# EAGLE design H-Bridge (EAGLE 4.11)
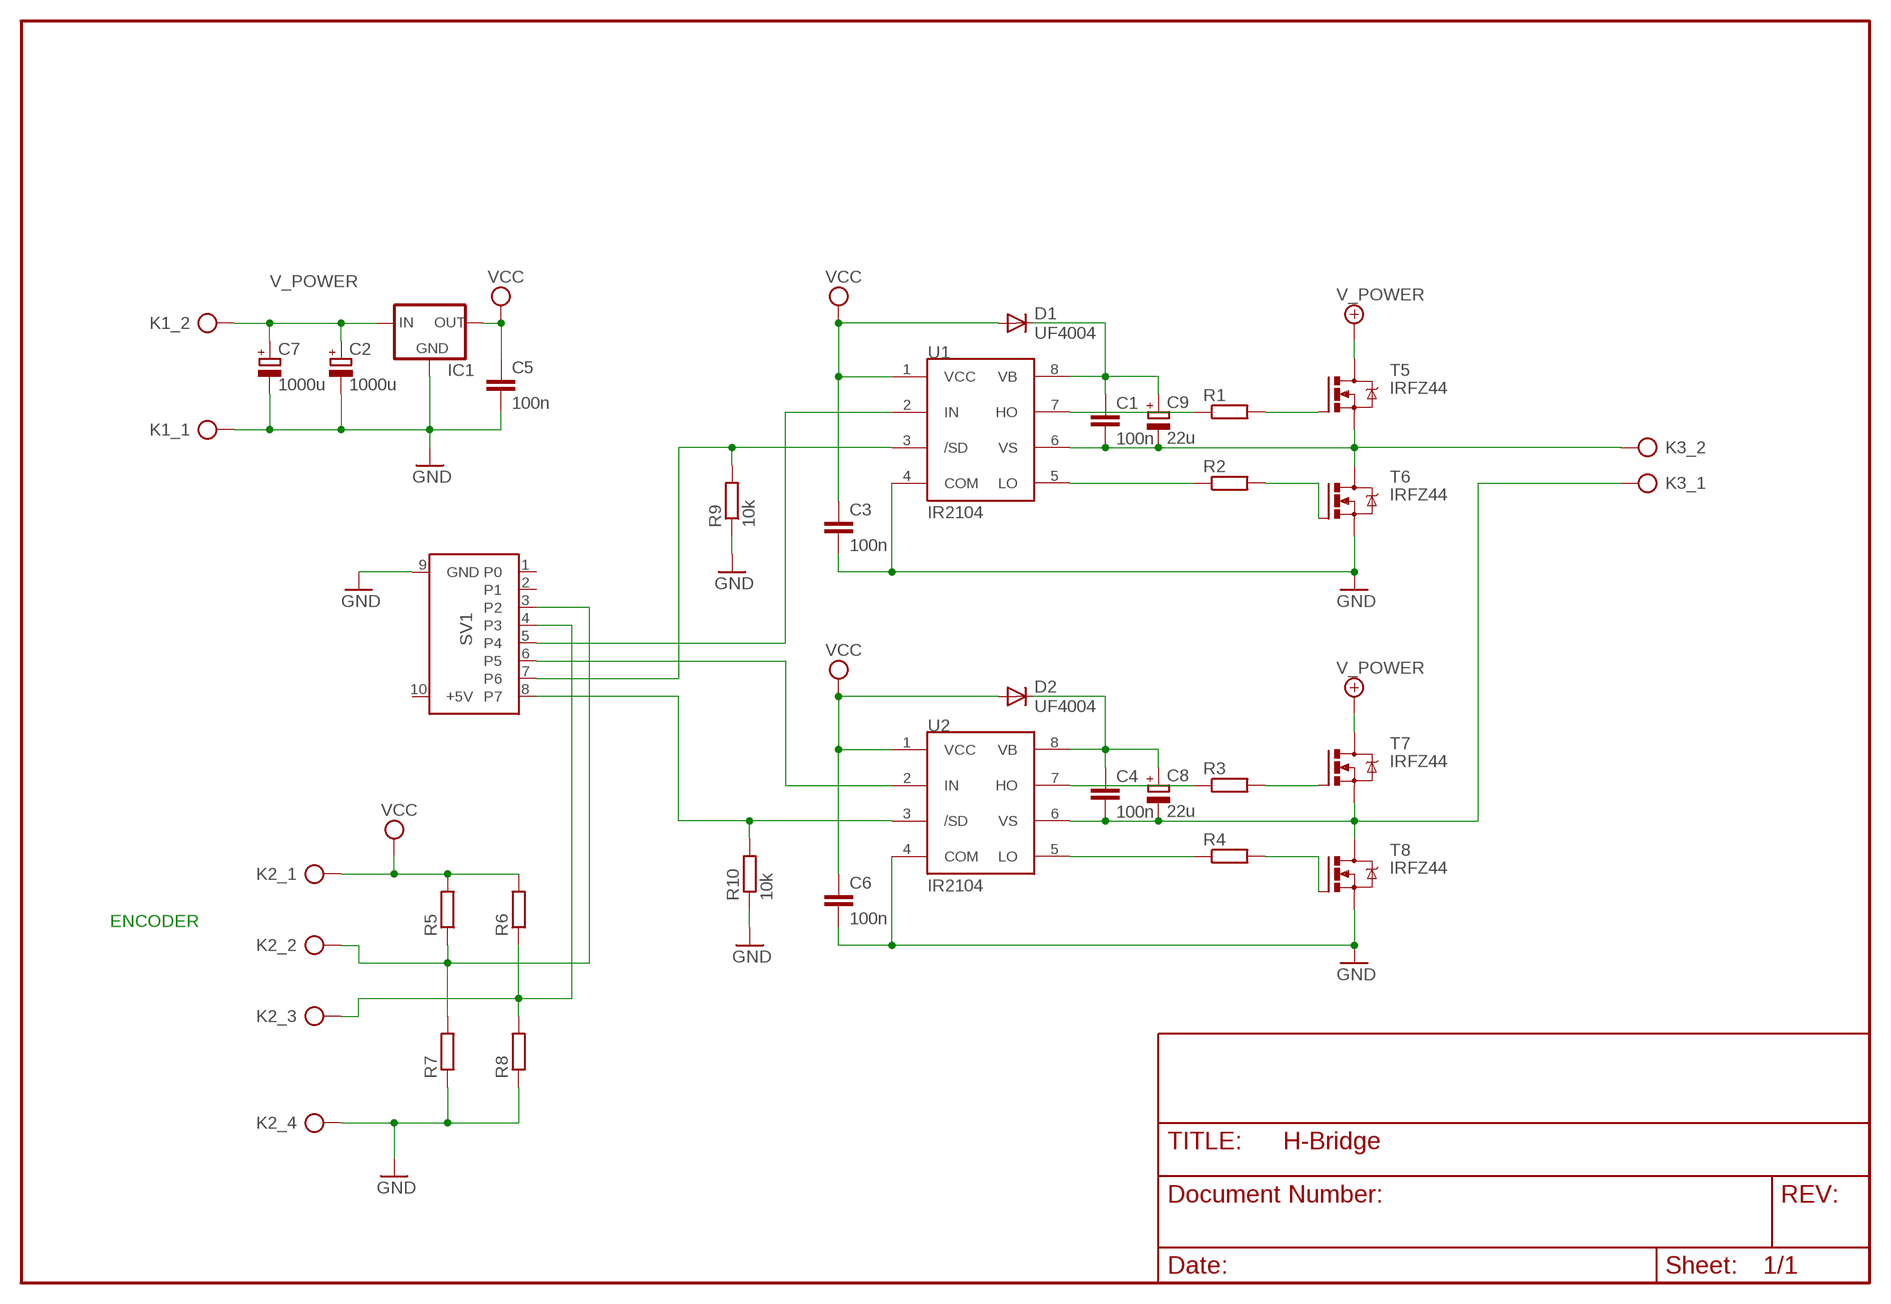
[diagram p0: schematic, sheet 1]

## Parts
C1  100n  C-EU050-025X075  [C050-025X075]
C2  1000u  CPOL-EUE5-13  [E5-13]
C3  100n  C-EU050-025X075  [C050-025X075]
C4  100n  C-EU050-025X075  [C050-025X075]
C5  100n  C-EU050-024X044  [C050-024X044]
C6  100n  C-EU050-025X075  [C050-025X075]
C7  1000u  CPOL-EUE5-13  [E5-13]
C8  22u  CPOL-EUE2.5-7  [E2,5-7]
C9  22u  CPOL-EUE2.5-7  [E2,5-7]
D1  UF4004  UF4003  [DO41-10]
D2  UF4004  UF4003  [DO41-10]
IC1  78MXXS  [78MXXS]
K1  AKL_KLEMME_2POLIG073  [AKL073-02]
K2  AST021-04  [AST021-04]
K3  AKL_KLEMME_2POLIG073  [AKL073-02]
R1  R-EU_0204/7  [0204/7]
R2  R-EU_0204/7  [0204/7]
R3  R-EU_0204/7  [0204/7]
R4  R-EU_0204/7  [0204/7]
R5  R-EU_0204/7  [0204/7]
R6  R-EU_0204/7  [0204/7]
R7  R-EU_0204/7  [0204/7]
R8  R-EU_0204/7  [0204/7]
R9  10k  R-EU_0204/7  [0204/7]
R10  10k  R-EU_0204/7  [0204/7]
SV1  PORT_WANNSTECKER  [ML10]
T5  IRFZ44  [78XXS]
T6  IRFZ44  [78XXS]
T7  IRFZ44  [78XXS]
T8  IRFZ44  [78XXS]
U1  IR2104  [DIL08]
U2  IR2104  [DIL08]

## Nets
GND: C2.- C3.2 C5.2 C6.2 C7.- IC1.GND K1.1 K2.4 R7.1 R8.1 R9.1 R10.1 SV1.9(GND) T6.S T8.S U1.4(COM) U2.4(COM)
N$1: C1.2 C9.- K3.2 T5.S T6.D U1.6(VS)
N$2: C4.2 C8.- K3.1 T7.S T8.D U2.6(VS)
N$3: R1.1 U1.7(HO)
N$4: R1.2 T5.G
N$5: R2.1 U1.5(LO)
N$6: R2.2 T6.G
N$7: R3.1 U2.7(HO)
N$8: R3.2 T7.G
N$9: R4.1 U2.5(LO)
N$10: R4.2 T8.G
N$11: SV1.5(P4) U1.2(IN)
N$12: SV1.6(P5) U2.2(IN)
N$13: R10.2 SV1.8(P7) U2.3(/SD)
N$14: R9.2 SV1.7(P6) U1.3(/SD)
N$15: K2.3 R6.1 R8.2 SV1.4(P3)
N$16: K2.2 R5.1 R7.2 SV1.3(P2)
V_POWER: C2.+ C7.+ IC1.IN K1.2 T5.D T7.D
VB1: C1.1 C9.+ D1.C U1.8(VB)
VB2: C4.1 C8.+ D2.C U2.8(VB)
VCC: C3.1 C5.1 C6.1 D1.A D2.A IC1.OUT K2.1 R5.2 R6.2 U1.1(VCC) U2.1(VCC)
Unconnected: SV1.1(P0) SV1.2(P1) SV1.10(+5V)

## Notes on the sheet
- ENCODER

## Library data of the parts
C1 C3-C6 = rcl:C-EU: CAPACITOR, European symbol
C2 C7-C9 = rcl:CPOL-EU: POLARIZED CAPACITOR, European symbol
D1 D2 = diode:UF4003: DIODE ultrafast recovery diode, 200 V rectifier
IC1 = v-reg:78MXXS: VOLTAGE REGULATOR
K1 = 01-Klemmen:AKL_KLEMME_2POLIG: Reichelt Klemme 2-Polig RM5,08
K2 = 01-Klemmen:AST021-04
K3 = FHO-Projekt:AKL_KLEMME_2POLIG: Reichelt Klemme 2-Polig RM5,08
R1-R10 = rcl:R-EU_: RESISTOR, European symbol
SV1 = FHO-Projekt:PORT_WANNSTECKER
T5-T8 = irf_voc:IRFZ44: VDSS = 55V RDS(on) = 17.5m? ID = 49A Advanced HEXFET® Power MOSFETs from International Rectifier utilize advanced processing techniques to achieve extremely low on-resistance per silicon area. This benefit, combined with the fast switching speed and ruggedized device design that HEXFET power MOSFETs are well known for, provides the designer with an extremely efficient and reliable device for use in a wide variety of applications.
U1 U2 = irf_voc:IR2104: High and low side driver

## Board
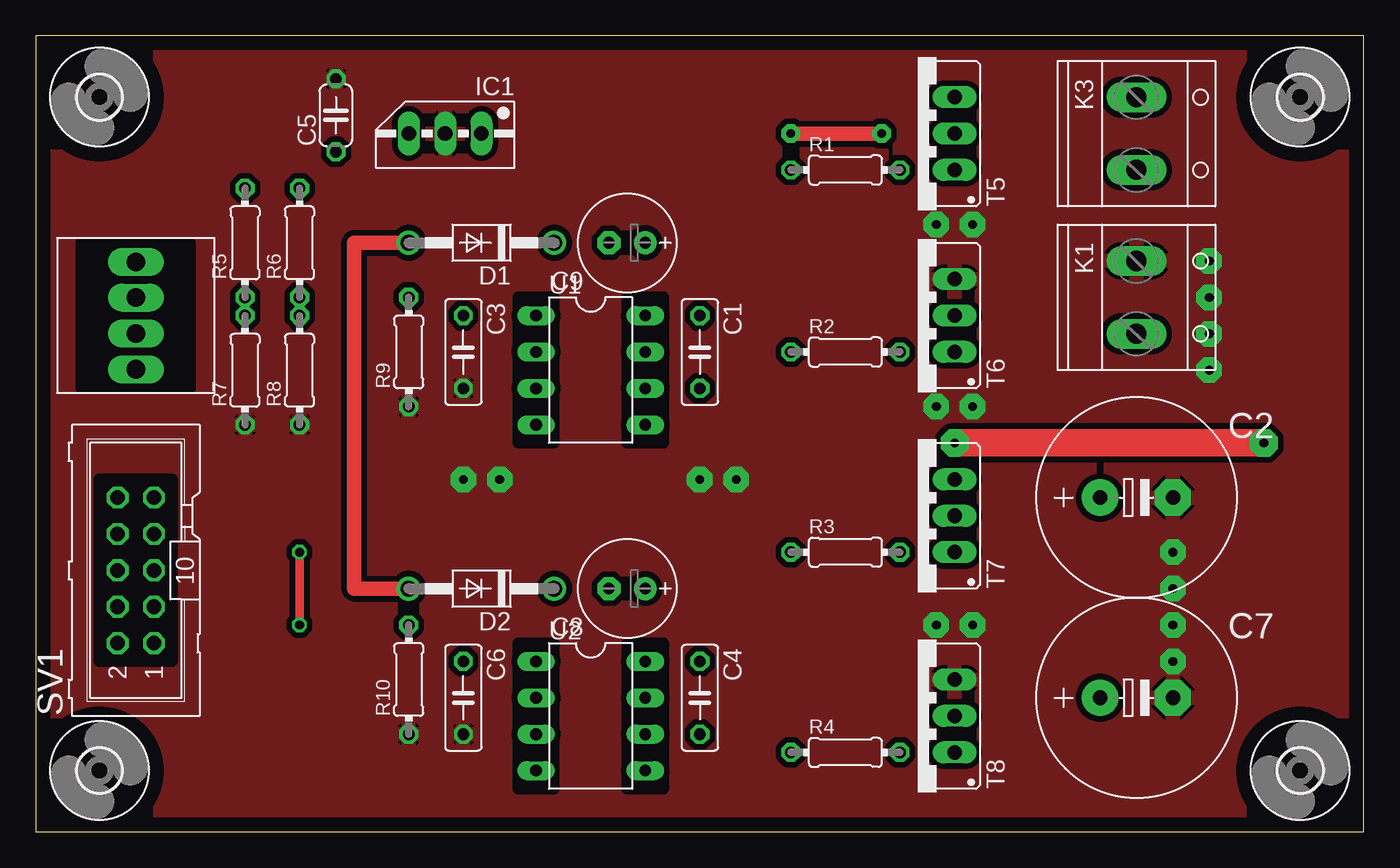
[diagram p1: board, top side]
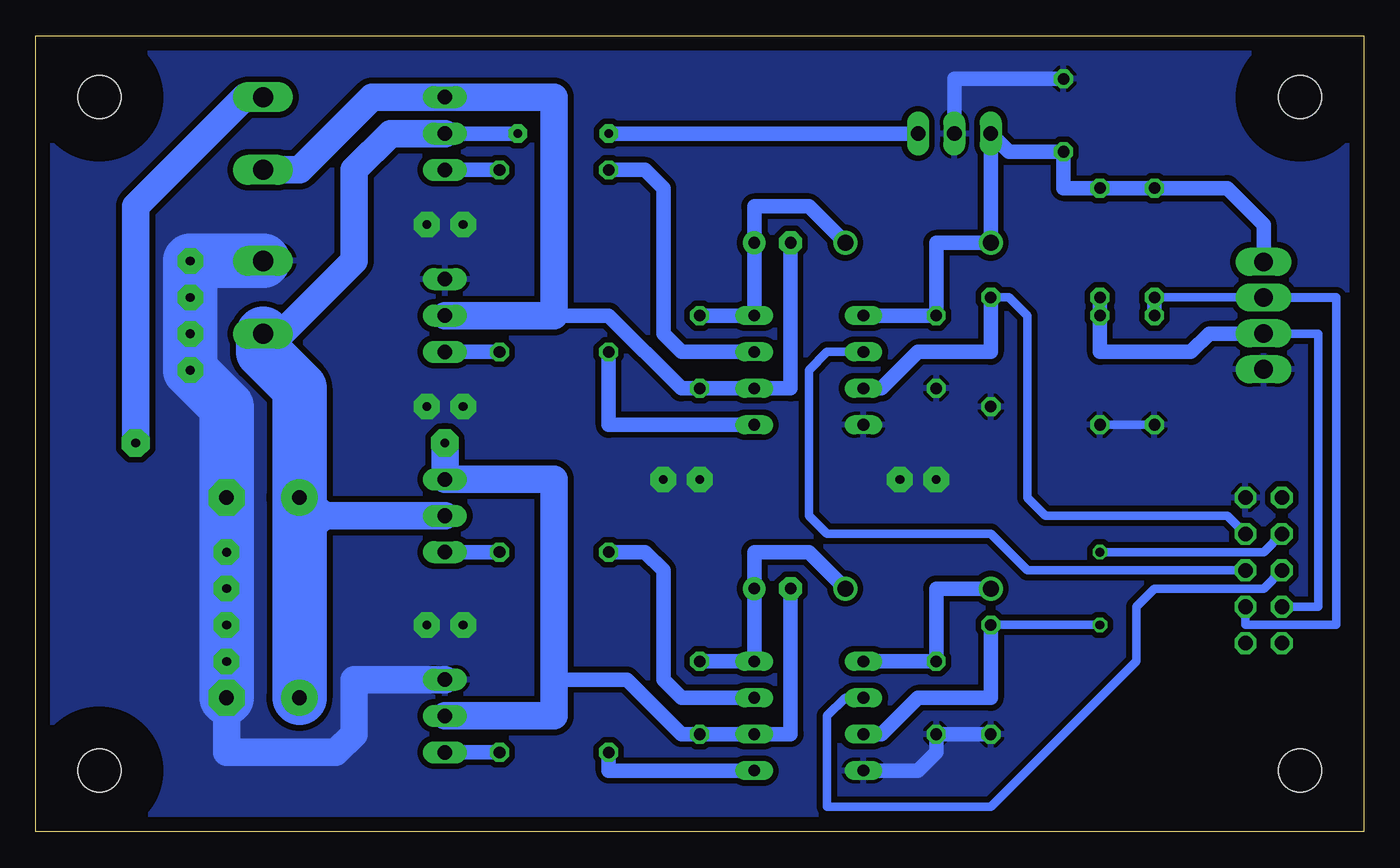
[diagram p2: board, bottom side, seen from below]

Size 92.69 x 55.55 mm. Coordinates in mm from the lower left corner, seen from the top.
Outline: 0,0 92.69,0 92.69,55.55 0,55.55 0,0
Copper layers (1*16): Top 0.035mm / dielectric 1.5mm / Bottom 0.035mm
Design rules "default": minimum track width 10mil, minimum drill 24mil, track to track 8mil, track to pad 8mil, pad to pad 8mil, via to via 8mil, smd to smd 8mil, copper to edge 40mil, drill to drill 8mil, minimum pad ring 10mil, minimum via ring 8mil, stop-mask expansion 4mil, vias tented up to drill 0mil, thermal gap 10mil
tRestrict: area 3.2,30.9 to 10.8,41.1; area 4.4,11.9 to 9.5,24.6; area 33.7,27.1 to 36.2,37.3; area 41.3,27.1 to 43.8,37.3; area 33.7,3 to 36.2,13.2; area 41.3,3 to 43.8,13.2

### Footprints (pad centres in the part's own frame; a part is rotated, then mirrored left to right if it is on the bottom)
C050-025X075 = drill 0.813 octagon: 1 -2.54,0; 2 2.54,0
E5-13 = drill 1.016 pad 2.54 round: + -2.54,0 | drill 1.016 pad 2.54 octagon: - 2.54,0
C050-024X044 = drill 0.813 octagon: 1 -2.54,0; 2 2.54,0
E2,5-7 = drill 0.813 pad 1.6 round: + -1.27,0 | drill 0.813 pad 1.6 octagon: - 1.27,0
DO41-10 = drill 1.118 round: A 5.08,0; C -5.08,0
78MXXS = drill 1.016 long: GND 0,-2.54; IN -2.54,-2.54; OUT 2.54,-2.54
AKL073-02 = drill 1.4 long: 1 -2.54,0; 2 2.54,0
AST021-04 = drill 1.3 long: 1 -3.75,0; 2 -1.25,0; 3 1.25,0; 4 3.75,0
0204/7 = drill 0.813 octagon: 1 -3.81,0; 2 3.81,0
ML10 = drill 1.016 octagon: 1 -5.08,-1.27; 2 -5.08,1.27; 3 -2.54,-1.27; 4 -2.54,1.27; 5 0,-1.27; 6 0,1.27; 7 2.54,-1.27; 8 2.54,1.27; 9 5.08,-1.27; 10 5.08,1.27
78XXS = drill 1.016 long: D 0,-2.54; G -2.54,-2.54; S 2.54,-2.54
DIL08 = drill 0.813 long: 1 -3.81,-3.81; 2 -1.27,-3.81; 3 1.27,-3.81; 4 3.81,-3.81; 5 3.81,3.81; 6 1.27,3.81; 7 -1.27,3.81; 8 -3.81,3.81
3,0 = hole 3: 0,0

### Placement (x,y rotation side)
C1  46.35,33.49 270 top
C2  76.83,23.33 0 top
C3  29.84,33.49 270 top
C4  46.35,9.36 270 top
C5  20.95,50 90 top
C6  29.84,9.36 270 top
C7  76.83,9.36 0 top
C8  41.27,16.98 180 top
C9  41.27,41.11 180 top
D1  31.11,41.11 180 top
D2  31.11,16.98 180 top
IC1  28.57,46.19 180 top
K1  76.83,37.3 270 top
K2  6.98,36.03 270 top
K3  76.83,48.73 270 top
R1  56.51,46.19 0 top
R2  56.51,33.49 0 top
R3  56.51,19.52 0 top
R4  56.51,5.55 0 top
R5  14.6,41.11 90 top
R6  18.41,41.11 90 top
R7  14.6,32.22 90 top
R8  18.41,32.22 90 top
R9  26.03,33.49 90 top
R10  26.03,10.63 90 top
SV1  6.98,18.25 90 top
T5  61.59,48.73 90 top
T6  61.59,36.03 90 top
T7  61.59,22.06 90 top
T8  61.59,8.09 90 top
U1  38.73,32.22 270 top
U2  38.73,8.09 270 top
U$1  [3,0]  4.44,51.27 0 top
U$2  [3,0]  4.44,4.28 180 top
U$3  [3,0]  88.26,4.28 0 top
U$4  [3,0]  88.26,51.27 0 top

### Tracks (layer width: path | path; a pad name or v marks a point on that pad's centre or on a via)
GND  (via drill 0.61 pad 1.78)
  Bottom 0.61: R7.1 R8.1
  Bottom 1.016: U2.4 31.11,4.28 29.84,5.55 C6.2 R10.1 | C5.2 28.57,52.54 IC1.GND
  Bottom 1.93: T8.S 70.48,10.63 70.48,6.82 71.75,5.55 79.37,5.55 C7.-
  Bottom 3.81: C7.- v79.37,11.9 v79.37,14.44 v79.37,16.98 v79.37,19.52 C2.- 79.37,29.68 v81.91,32.22 v81.91,34.76 v81.91,37.3 v81.91,39.84 K1.1
  other vias: 48.89,24.6 46.35,24.6 32.38,24.6 29.84,24.6 65.4,29.68 62.86,29.68 62.86,42.38 65.4,42.38 62.86,14.44 65.4,14.44
  pour Bottom (isolate 0.406): 0.63,55.08 92.07,55.08 92.07,0.47 0.63,0.47
  pour Top (isolate 0.406): 0.63,55.08 92.07,55.08 92.07,0.47 0.63,0.47
N$1
  Bottom 1.016: C9.- 40,30.95 U1.6 C1.2 47.62,30.95 52.7,36.03 56.51,36.03
  Bottom 1.93: T6.D 56.51,36.03 56.51,51.27 T5.S 69.21,51.27 74.29,46.19 K3.2
N$2  (via drill 0.61 pad 1.93)
  Top 1.93: v64.13,27.14 v85.72,27.14
  Bottom 1.016: C8.- 40,6.82 U2.6 C4.2 47.62,6.82 51.43,10.63 56.51,10.63
  Bottom 1.93: T8.D 56.51,8.09 56.51,10.63 56.51,24.6 T7.S v64.13,27.14 | v85.72,27.14 85.72,43.65 78.1,51.27 K3.1
N$3
  Bottom 1.016: U1.7 47.62,33.49 48.89,34.76 48.89,41.11 48.89,44.92 50.16,46.19 R1.1
N$4
  Bottom 1.016: R1.2 T5.G
N$5
  Bottom 1.016: U1.5 52.7,28.41 R2.1
N$6
  Bottom 1.016: R2.2 T6.G
N$7
  Bottom 1.016: U2.7 47.62,9.36 48.89,10.63 48.89,18.25 50.16,19.52 R3.1
N$8
  Bottom 1.016: R3.2 T7.G
N$9
  Bottom 1.016: U2.5 52.7,4.28 R4.1
N$10
  Bottom 1.016: R4.2 T8.G
N$11
  Bottom 0.61: SV1.5 17.14,18.25 23.49,18.25 26.03,20.79 37.46,20.79 38.73,22.06 38.73,32.22 37.46,33.49 U1.2
N$12
  Bottom 0.61: SV1.6 6.98,16.98 14.6,16.98 15.87,15.71 15.87,11.9 26.03,1.74 37.46,1.74 37.46,8.09 36.19,9.36 U2.2
N$13  (via drill 0.61)
  Top 0.61: v18.41,19.52 v18.41,14.44
  Bottom 0.61: SV1.8 6.98,19.52 v18.41,19.52 | v18.41,14.44 R10.2
  Bottom 1.016: U2.3 33.65,6.82 31.11,9.36 26.03,9.36 R10.2
N$14
  Bottom 0.61: R9.2 24.76,37.3 23.49,36.03 23.49,23.33 22.22,22.06 9.52,22.06 SV1.7
  Bottom 1.016: R9.2 26.03,33.49 31.11,33.49 33.65,30.95 U1.3
N$15
  Bottom 0.61: 6.98,34.76 3.17,34.76 3.17,15.71 SV1.4
  Bottom 1.016: K2.3 6.98,34.76 10.79,34.76 12.06,33.49 18.41,33.49 R8.2 R6.1
N$16
  Bottom 0.61: 1.9,37.3 6.98,37.3 R5.1 | K2.2 1.9,37.28 1.9,14.44 8.25,14.44 SV1.3
  Bottom 1.016: K2.2 6.98,37.3 | R5.1 R7.2
V_POWER  (via drill 0.61 pad 1.27)
  Top 1.016: v52.7,48.73 v59.05,48.73
  Bottom 1.016: v59.05,48.73 T5.D | IC1.IN v52.7,48.73
  Bottom 1.93: 73.02,22.06 T7.D | K1.2 75.56,34.76 70.48,39.84 70.48,46.19 67.94,48.73 T5.D
  Bottom 2.54: C2.+ 73.02,22.06
  Bottom 3.81: K1.2 76.83,33.49 74.29,30.95 C2.+ C7.+
VB1
  Bottom 1.016: C1.1 U1.8 C9.+ 42.54,43.65 38.73,43.65 D1.C
VB2
  Bottom 1.016: D2.C 38.73,19.52 42.54,19.52 C8.+ U2.8 C4.1
VCC
  Top 1.016: D1.A 22.22,41.11 22.22,16.98 D2.A
  Bottom 1.016: K2.1 6.98,42.38 9.52,44.92 R5.2 R6.2 20.95,44.92 C5.1 24.76,47.46 IC1.OUT D1.A 29.84,41.11 C3.1 U1.1 | D2.A 29.84,16.98 C6.1 U2.1